# Altium project 15VFix.PrjPcb
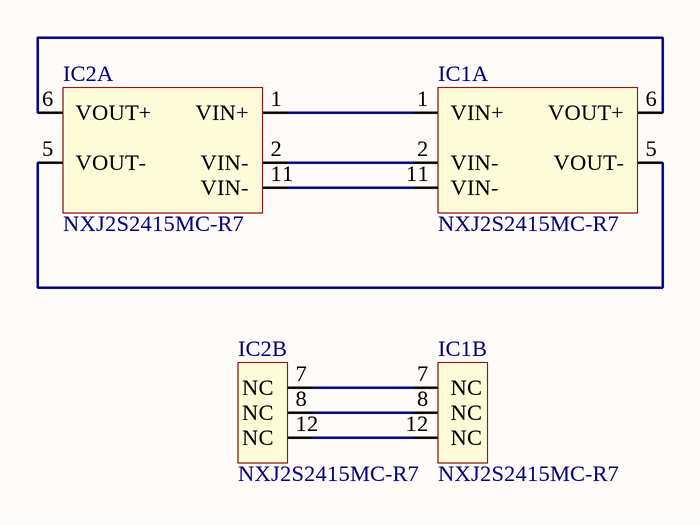
[diagram p0: Sheet1.SchDoc]
1 sheet, 2 parts. Net scope: global (net labels, ports and power ports of the same name join across sheets).
Board file: PCB1.PcbDoc

## Sheet Sheet1.SchDoc
size A4; SheetNumber: 1; SheetTotal: 1

### Parts
IC1  NXJ2S2415MC-R7  [DCDC]  (parts A,B of 2)
IC2  NXJ2S2415MC-R7  [DCDC]  (parts A,B of 2)

### Nets
NetIC1_1: IC1.1(VIN+) IC2.1(VIN+)
NetIC1_2: IC1.2(VIN-) IC2.2(VIN-)
NetIC1_5: IC1.5(VOUT-) IC2.5(VOUT-)
NetIC1_6: IC1.6(VOUT+) IC2.6(VOUT+)
NetIC1_7: IC1.7(NC) IC2.7(NC)
NetIC1_8: IC1.8(NC) IC2.8(NC)
NetIC1_11: IC1.11(VIN-) IC2.11(VIN-)
NetIC1_12: IC1.12(NC) IC2.12(NC)

### Notes on the sheet
- Title
- Revision:
- Design Engineer:
- Date:
- Project:
- Sheet
- of

### Library data of the parts
IC1 IC2 = NXJ2S2415MC-R7: Isolated DC/DC Converters - SMD 21.6V TO 26.4V IN 15V OUT; Manufacturer: Murata; Value: 2 W; Created from: VStarost; Manufacturer Part Number: NXJ2S2415MC-R7; PartID: 25; Created On: 13.12.2022 13:30:59; ComponentLink1Description: Datasheet; ComponentLink1URL: https://www.mouser.de/datasheet/2/281/1/kdc_nxj2-2941192.pdf; Component Type: DC-DC Converter; Device Package: -; Last Updated: 13.12.2022 13:30:59; Mounting Type: SMD; Operating Temperature: -40 - 85 °C; Series: NXJ2; Supplier 1: Mouser; Supplier Part Number 1: 580-NXJ2S2415MC-R7; Type: isolated DC-DC Converter; Live Cycle Status: 1; Stock number: not stored